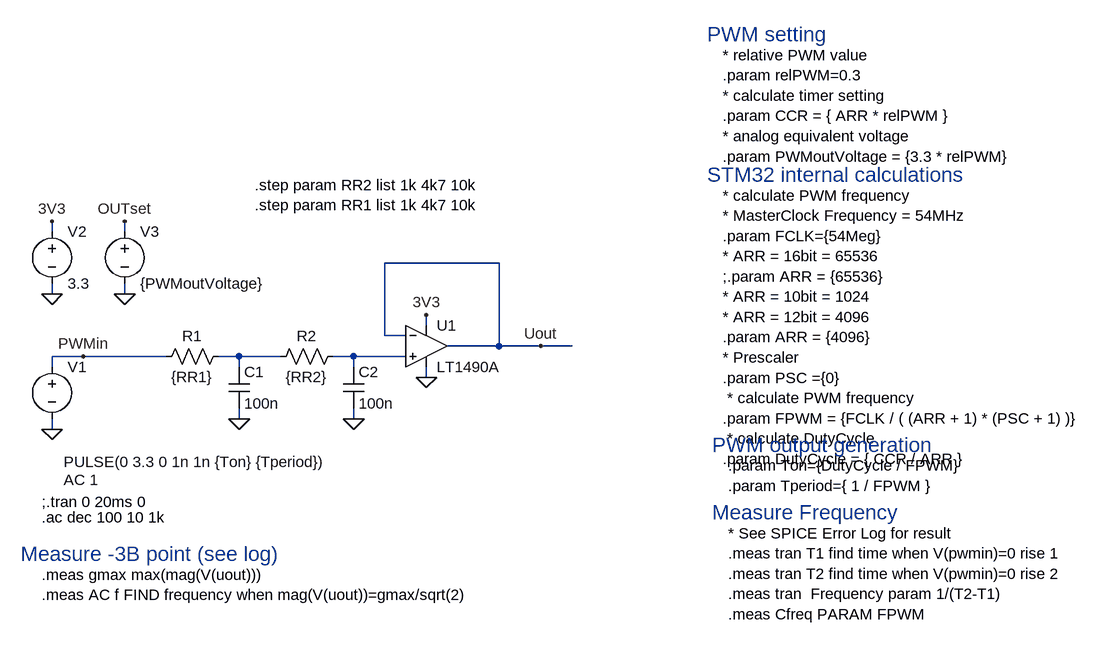
[diagram p0: schematic pwm_filter_v1.asc]
pwm_filter_v1.asc, the LTspice schematic file:
Version 4
SHEET 1 1648 680
WIRE -384 -208 -384 -224
WIRE -272 -208 -272 -224
WIRE 304 -160 128 -160
WIRE -384 -112 -384 -128
WIRE -272 -112 -272 -128
WIRE 192 -64 192 -80
WIRE 128 -48 128 -160
WIRE 160 -48 128 -48
WIRE 304 -32 304 -160
WIRE 304 -32 224 -32
WIRE 368 -32 304 -32
WIRE 416 -32 368 -32
WIRE -336 -16 -384 -16
WIRE -208 -16 -336 -16
WIRE -96 -16 -128 -16
WIRE -32 -16 -96 -16
WIRE 80 -16 48 -16
WIRE 160 -16 80 -16
WIRE -384 0 -384 -16
WIRE -96 0 -96 -16
WIRE 80 0 80 -16
WIRE 192 16 192 0
WIRE -96 80 -96 64
WIRE 80 80 80 64
WIRE -384 96 -384 80
FLAG 192 16 0
FLAG -384 96 0
FLAG -96 80 0
FLAG 80 80 0
FLAG -384 -112 0
FLAG -384 -224 3V3
FLAG 192 -80 3V3
FLAG -336 -16 PWMin
FLAG 368 -32 Uout
FLAG -272 -112 0
FLAG -272 -224 OUTset
SYMBOL res -112 -32 R90
WINDOW 0 0 56 VBottom 2
WINDOW 3 32 56 VTop 2
SYMATTR InstName R1
SYMATTR Value {RR1}
SYMBOL res 64 -32 R90
WINDOW 0 0 56 VBottom 2
WINDOW 3 32 56 VTop 2
SYMATTR InstName R2
SYMATTR Value {RR2}
SYMBOL cap -112 0 R0
SYMATTR InstName C1
SYMATTR Value 100n
SYMBOL cap 64 0 R0
SYMATTR InstName C2
SYMATTR Value 100n
SYMBOL Opamps\\LT1490A 192 -96 R0
SYMATTR InstName U1
SYMBOL voltage -384 -16 R0
WINDOW 3 18 162 Left 2
WINDOW 123 18 190 Left 2
WINDOW 39 0 0 Left 0
SYMATTR Value PULSE(0 3.3 0 1n 1n {Ton} {Tperiod})
SYMATTR Value2 AC 1
SYMATTR InstName V1
SYMBOL voltage -384 -224 R0
WINDOW 123 0 0 Left 0
WINDOW 39 0 0 Left 0
SYMATTR InstName V2
SYMATTR Value 3.3
SYMBOL voltage -272 -224 R0
WINDOW 123 0 0 Left 0
WINDOW 39 0 0 Left 0
SYMATTR InstName V3
SYMATTR Value {PWMoutVoltage}
TEXT 656 152 Left 2 !.param Ton={DutyCycle / FPWM}\n.param Tperiod={ 1 / FPWM }
TEXT -400 208 Left 2 !;.tran 0 20ms 0
TEXT 648 -264 Left 2 !* calculate PWM frequency\n* MasterClock Frequency = 54MHz\n.param FCLK={54Meg}\n* ARR = 16bit = 65536\n;.param ARR = {65536}\n* ARR = 10bit = 1024\n* ARR = 12bit = 4096\n.param ARR = {4096}\n* Prescaler\n.param PSC ={0}\n * calculate PWM frequency\n.param FPWM = {FCLK / ( (ARR + 1) * (PSC + 1) )}\n * calculate DutyCycle\n.param DutyCycle = { CCR / ARR }
TEXT 648 -480 Left 2 !* relative PWM value\n.param relPWM=0.3\n* calculate timer setting\n.param CCR = { ARR * relPWM }\n* analog equivalent voltage\n.param PWMoutVoltage = {3.3 * relPWM}
TEXT 624 -512 Left 3 ;PWM setting
TEXT 624 -296 Left 3 ;STM32 internal calculations
TEXT 656 256 Left 2 !* See SPICE Error Log for result\n.meas tran T1 find time when V(pwmin)=0 rise 1\n.meas tran T2 find time when V(pwmin)=0 rise 2\n.meas tran  Frequency param 1/(T2-T1)\n.meas Cfreq PARAM FPWM
TEXT 632 120 Left 3 ;PWM output generation
TEXT 632 224 Left 3 ;Measure Frequency
TEXT -400 232 Left 2 !.ac dec 100 10 1k
TEXT -400 320 Left 2 !.meas gmax max(mag(V(uout)))\n.meas AC f FIND frequency when mag(V(uout))=gmax/sqrt(2)
TEXT -432 288 Left 3 ;Measure -3B point (see log)
TEXT -72 -280 Left 2 !.step param RR2 list 1k 4k7 10k\n.step param RR1 list 1k 4k7 10k

The netlist it stands for:
* pwm_filter_v1.asc
R1 N001 PWMin {RR1}
R2 N002 N001 {RR2}
C1 N001 0 100n
C2 N002 0 100n
XU1 N002 Uout 3V3 0 Uout LT1490A  ; pins In+ In- V+ V- OUT
V1 PWMin 0 PULSE(0 3.3 0 1n 1n {Ton} {Tperiod}) AC 1
V2 3V3 0 3.3
V3 OUTset 0 {PWMoutVoltage}
.param Ton={DutyCycle / FPWM}
.param Tperiod={ 1 / FPWM }
;.tran 0 20ms 0
* calculate PWM frequency
* MasterClock Frequency = 54MHz
.param FCLK={54Meg}
* ARR = 16bit = 65536
;.param ARR = {65536}
* ARR = 10bit = 1024
* ARR = 12bit = 4096
.param ARR = {4096}
* Prescaler
.param PSC ={0}
 * calculate PWM frequency
.param FPWM = {FCLK / ( (ARR + 1) * (PSC + 1) )}
 * calculate DutyCycle
.param DutyCycle = { CCR / ARR }
* relative PWM value
.param relPWM=0.3
* calculate timer setting
.param CCR = { ARR * relPWM }
* analog equivalent voltage
.param PWMoutVoltage = {3.3 * relPWM}
* PWM setting
* STM32 internal calculations
* See SPICE Error Log for result
.meas tran T1 find time when V(pwmin)=0 rise 1
.meas tran T2 find time when V(pwmin)=0 rise 2
.meas tran  Frequency param 1/(T2-T1)
.meas Cfreq PARAM FPWM
* PWM output generation
* Measure Frequency
.ac dec 100 10 1k
.meas gmax max(mag(V(uout)))
.meas AC f FIND frequency when mag(V(uout))=gmax/sqrt(2)
* Measure -3B point (see log)
.step param RR2 list 1k 4k7 10k
.step param RR1 list 1k 4k7 10k
.backanno
.end